# EAGLE design circuit (EAGLE 9.6.0)
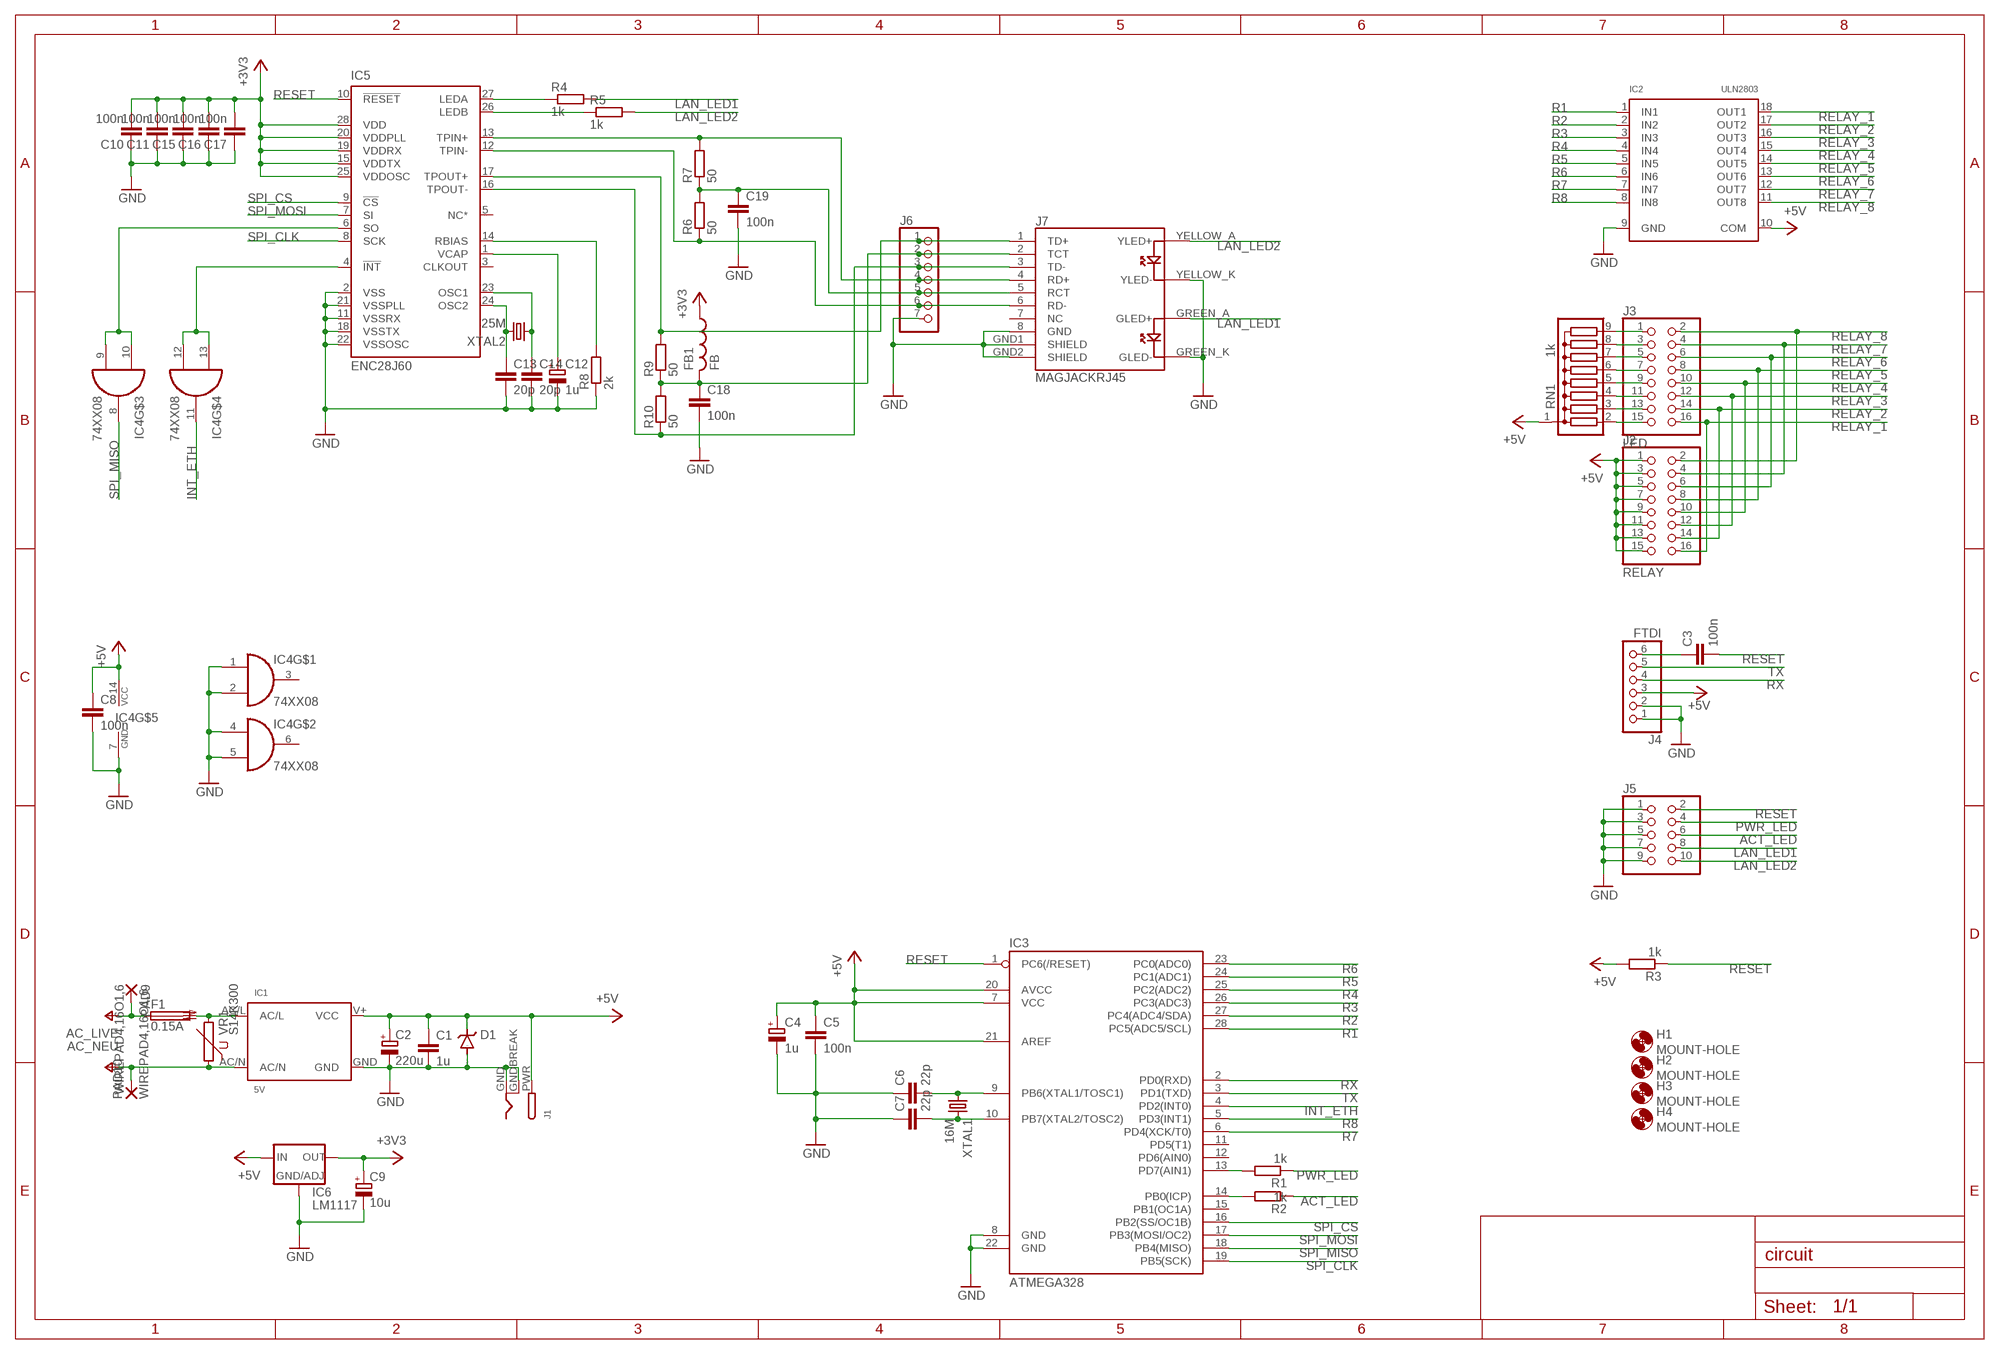
[diagram p0: schematic, sheet 1]

## Parts
C1  1u  CAPACITORC050-025X075  [C050-025X075]
C2  220u  CAPACITOR_POL2.5/6  [E2,5-6]
C3  100n  CAPACITORC050-025X075  [C050-025X075]
C4  1u  CAPACITOR_POL5/5  [E5-5]
C5  100n  CAPACITORC050-025X075  [C050-025X075]
C6  22p  CAPACITORC025-025X050  [C025-025X050]
C7  22p  CAPACITORC025-025X050  [C025-025X050]
C8  100n  CAPACITORC050-025X075  [C050-025X075]
C9  10u  CAPACITOR_POL5/5  [E5-5]
C10  100n  CAPACITORC050-025X075  [C050-025X075]
C11  100n  CAPACITORC050-025X075  [C050-025X075]
C12  1u  CAPACITOR_POL5/5  [E5-5]
C13  20p  CAPACITORC025-025X050  [C025-025X050]
C14  20p  CAPACITORC025-025X050  [C025-025X050]
C15  100n  CAPACITORC050-025X075  [C050-025X075]
C16  100n  CAPACITORC050-025X075  [C050-025X075]
C17  100n  CAPACITORC050-025X075  [C050-025X075]
C18  100n  CAPACITORC050-025X075  [C050-025X075]
C19  100n  CAPACITORC050-025X075  [C050-025X075]
D1  DIODE-TVSDO15  [DO15]
F1  0.15A  5X20_FUSE  [5X20_FUSE]
FB1  FB  [FB]
H1  MOUNT-HOLE  [3,2]
H2  MOUNT-HOLE  [3,2]
H3  MOUNT-HOLE  [3,2]
H4  MOUNT-HOLE  [3,2]
IC1  5V  AC-DC_PSUAMEL10  [LD/AMEL10]
IC2  ULN2803  [DIL18]
IC3  ATMEGA328  [DIL28]
IC4  74XX08  [DIL14]
IC5  ENC28J60  [DIL28]
IC6  LM1117  [TO220V]
J1  DCBARRELPTH  [DCJACK_2MM_PTH]
J2  RELAY  PINHD-2X8  [2X08]
J3  LED  PINHD-2X8  [2X08]
J4  FTDI  PINHD-1X6  [1X06]
J5  PINHD-2X5  [2X05]
J6  PINHD-1X7  [1X07]
J7  MAGJACKRJ45  [MAGJACK]
PAD9  WIREPAD4,16O1,6  [4,16O1,6]
PAD10  WIREPAD4,16O1,6  [4,16O1,6]
R1  1k  RESISTOR  [0207/10]
R2  1k  RESISTOR  [0207/10]
R3  1k  RESISTOR  [0207/10]
R4  1k  RESISTOR  [0207/10]
R5  1k  RESISTOR  [0207/10]
R6  50  RESISTOR  [0207/10]
R7  50  RESISTOR  [0207/10]
R8  2k  RESISTOR  [0207/10]
R9  50  RESISTOR  [0207/10]
R10  50  RESISTOR  [0207/10]
RN1  1k  G08R  [SIL9]
VR1  S14K300  [S14K300]
XTAL1  16M  CRYSTAL  [HC49/S]
XTAL2  25M  CRYSTAL  [HC49/S]

## Nets
+3V3: C9.+ C10.2 C11.2 C15.2 C16.2 C17.2 FB1.P$1 IC5.15(VDDTX) IC5.19(VDDRX) IC5.20(VDDPLL) IC5.25(VDDOSC) IC5.28(VDD) IC6.2(OUT)
+5V: C1.1 C2.+ C4.+ C5.1 C8.1 D1.C IC1.V+(VCC) IC2.10(COM) IC3.7(VCC) IC3.20(AVCC) IC3.21(AREF) IC4.14(VCC) IC6.3(IN) J1.PWR J2.1 J2.3 J2.5 J2.7 J2.9 J2.11 J2.13 J2.15 J4.3 R3.2 RN1.1
ACT_LED: J5.6 R2.1
GND: C1.2 C2.- C4.- C5.2 C6.1 C7.1 C8.2 C9.- C10.1 C11.1 C12.- C13.2 C14.2 C15.1 C16.1 C17.1 C18.2 C19.2 D1.A IC1.GND IC2.9(GND) IC3.8(GND) IC3.22(GND) IC4.1(I0) IC4.2(I1) IC4.4(I0) IC4.5(I1) IC4.7(GND) IC5.2(VSS) IC5.11(VSSRX) IC5.18(VSSTX) IC5.21(VSSPLL) IC5.22(VSSOSC) IC6.1(GND/ADJ) J1.GND J1.GNDBREAK J4.1 J4.2 J5.1 J5.3 J5.5 J5.7 J5.9 J6.7 J7.8(GND) J7.GND1(SHIELD) J7.GND2(SHIELD) J7.GREEN_K(GLED-) J7.YELLOW_K(YLED-) R8.1
INT_ETH: IC3.4(PD2(INT0)) IC4.11(O)
LAN_LED1: J5.8 J7.GREEN_A(GLED+) R4.2
LAN_LED2: J5.10 J7.YELLOW_A(YLED+) R5.2
N$3: IC5.16(TPOUT-) J6.3 J7.3(TD-) R10.1
N$4: C19.1 J6.5 J7.5(RCT) R6.2 R7.1
N$5: IC5.17(TPOUT+) J6.1 J7.1(TD+) R9.2
N$7: J3.15 RN1.2
N$8: J3.13 RN1.3
N$9: F1.2A F1.2B IC1.AC/L VR1.2
N$10: IC4.9(I1) IC4.10(I0) IC5.6(SO)
N$11: J3.11 RN1.4
N$12: IC4.12(I1) IC4.13(I0) IC5.4(!INT)
N$13: J3.9 RN1.5
N$14: J3.7 RN1.6
N$15: J3.5 RN1.7
N$16: J3.3 RN1.8
N$18: C18.1 FB1.P$2 J6.2 J7.2(TCT) R9.1 R10.2
N$20: IC5.13(TPIN+) J6.4 J7.4(RD+) R7.2
N$22: IC5.12(TPIN-) J6.6 J7.6(RD-) R6.1
N$25: IC5.27(LEDA) R4.1
N$26: IC5.26(LEDB) R5.1
N$27: IC3.13(PD7(AIN1)) R1.2
N$28: IC3.14(PB0(ICP)) R2.2
N$29: J3.1 RN1.9
N$32: C3.1 J4.6
N$33: C13.1 IC5.24(OSC2) XTAL2.2
N$34: C14.1 IC5.23(OSC1) XTAL2.1
N$35: C12.+ IC5.1(VCAP)
N$36: IC5.14(RBIAS) R8.2
N$38: C6.2 IC3.9(PB6(XTAL1/TOSC1)) XTAL1.1
N$39: C7.2 IC3.10(PB7(XTAL2/TOSC2)) XTAL1.2
PWR_LED: J5.4 R1.1
R1: IC2.1(IN1) IC3.28(PC5(ADC5/SCL))
R2: IC2.2(IN2) IC3.27(PC4(ADC4/SDA))
R3: IC2.3(IN3) IC3.26(PC3(ADC3))
R4: IC2.4(IN4) IC3.25(PC2(ADC2))
R5: IC2.5(IN5) IC3.24(PC1(ADC1))
R6: IC2.6(IN6) IC3.23(PC0(ADC0))
R7: IC2.7(IN7) IC3.6(PD4(XCK/T0))
R8: IC2.8(IN8) IC3.5(PD3(INT1))
RELAY_1: IC2.18(OUT1) J2.16 J3.16
RELAY_2: IC2.17(OUT2) J2.14 J3.14
RELAY_3: IC2.16(OUT3) J2.12 J3.12
RELAY_4: IC2.15(OUT4) J2.10 J3.10
RELAY_5: IC2.14(OUT5) J2.8 J3.8
RELAY_6: IC2.13(OUT6) J2.6 J3.6
RELAY_7: IC2.12(OUT7) J2.4 J3.4
RELAY_8: IC2.11(OUT8) J2.2 J3.2
RESET: C3.2 IC3.1(PC6(/RESET)) IC5.10(!RESET) J5.2 R3.1
RX: IC3.2(PD0(RXD)) J4.4
SPI_CLK: IC3.19(PB5(SCK)) IC5.8(SCK)
SPI_CS: IC3.16(PB2(SS/OC1B)) IC5.9(!CS)
SPI_MISO: IC3.18(PB4(MISO)) IC4.8(O)
SPI_MOSI: IC3.17(PB3(MOSI/OC2)) IC5.7(SI)
TX: IC3.3(PD1(TXD)) J4.5
V+: F1.1A F1.1B PAD9.1(P) ; supply symbol labelled AC_LIVE
V-: IC1.AC/N PAD10.1(P) VR1.1 ; supply symbol labelled AC_NEU
Unconnected: IC3.11(PD5(T1)) IC3.12(PD6(AIN0)) IC3.15(PB1(OC1A)) IC4.3(O) IC4.6(O) IC5.3(CLKOUT) IC5.5(NC*) J7.7(NC)

## Library data of the parts
C1 C3 C5-C8 C10 C11 C13-C19 = THT:CAPACITOR
C2 C4 C9 C12 = THT:CAPACITOR_POL
D1 = THT:DIODE-TVS
F1 = THT:5X20_FUSE
FB1 = THT:FB: Ferrite bead Digikey #P9821BK-ND
H1-H4 = THT:MOUNT-HOLE
IC1 = THT:AC-DC_PSU
IC2 = THT:ULN2803
IC3 = THT:ATMEGA328
IC4 = THT:74XX08
IC5 = THT:ENC28J60
IC6 = THT:LM1117
J1 = THT:DCBARREL: 2.0mm DC Barrel Jack DCJACK_2MM_PTH - Through Hole Jack (4UConnector: 05537)
J2 J3 = THT:PINHD-2X8: PIN HEADER
J4 = THT:PINHD-1X6: PIN HEADER
J5 = THT:PINHD-2X5: PIN HEADER
J6 = THT:PINHD-1X7: PIN HEADER
J7 = THT:MAGJACK: MAGJACK: RJ-45 with LEDs This is a single port, RJ45 ethernet jacks with built in transformer (magnetics), status LEDs, and shielding. Here is the connector we sell at SparkFun: RJ45 Ethernet MagJack-Compatible <https://www.sparkfun.com/products/8534> (PRT-08534) Datasheet <http://www.sparkfun.com/datasheets/Prototyping/MagJack.pdf> It is used on this SparkFun product: SparkFun RJ45 MagJack Breakout <https://www.sparkfun.com/products/13021> (BOB-13021)
PAD9 PAD10 = THT:WIREPAD: Wire PAD connect wire on PCB
R1-R10 = THT:RESISTOR
RN1 = THT:G08R: SIL RESISTOR; OC_FARNELL: unknown; OC_NEWARK: unknown
VR1 = THT:S14K300: VARISTOR
XTAL1 XTAL2 = THT:CRYSTAL

## Board
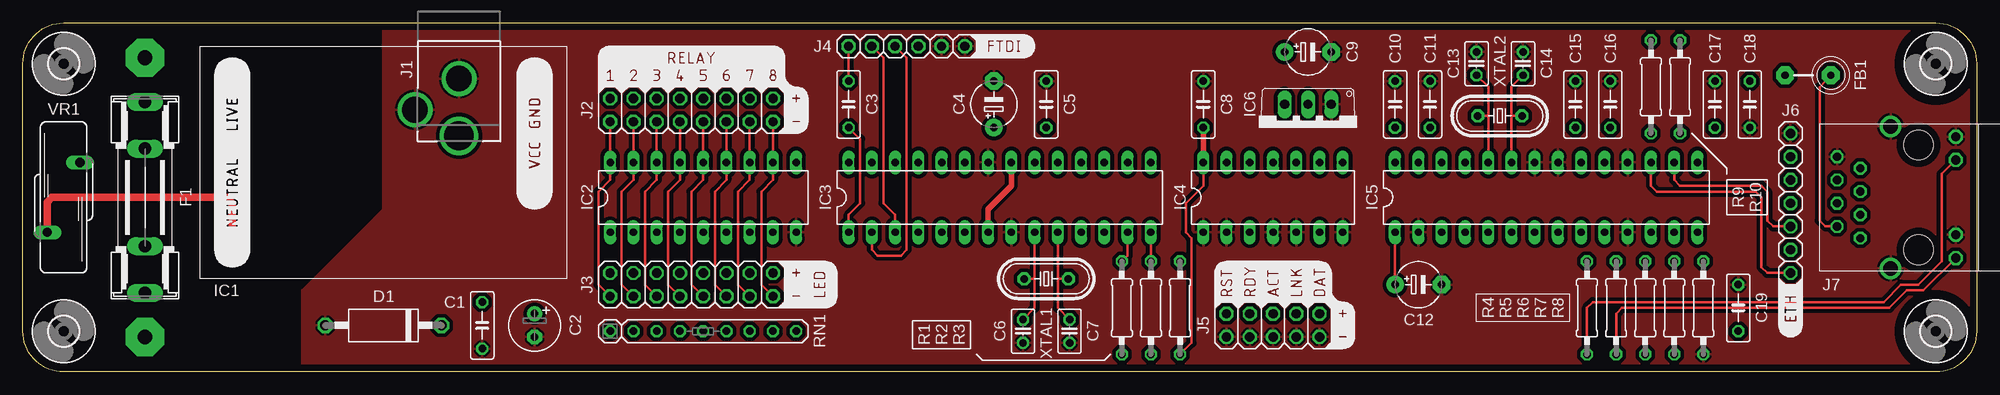
[diagram p1: board, top side]
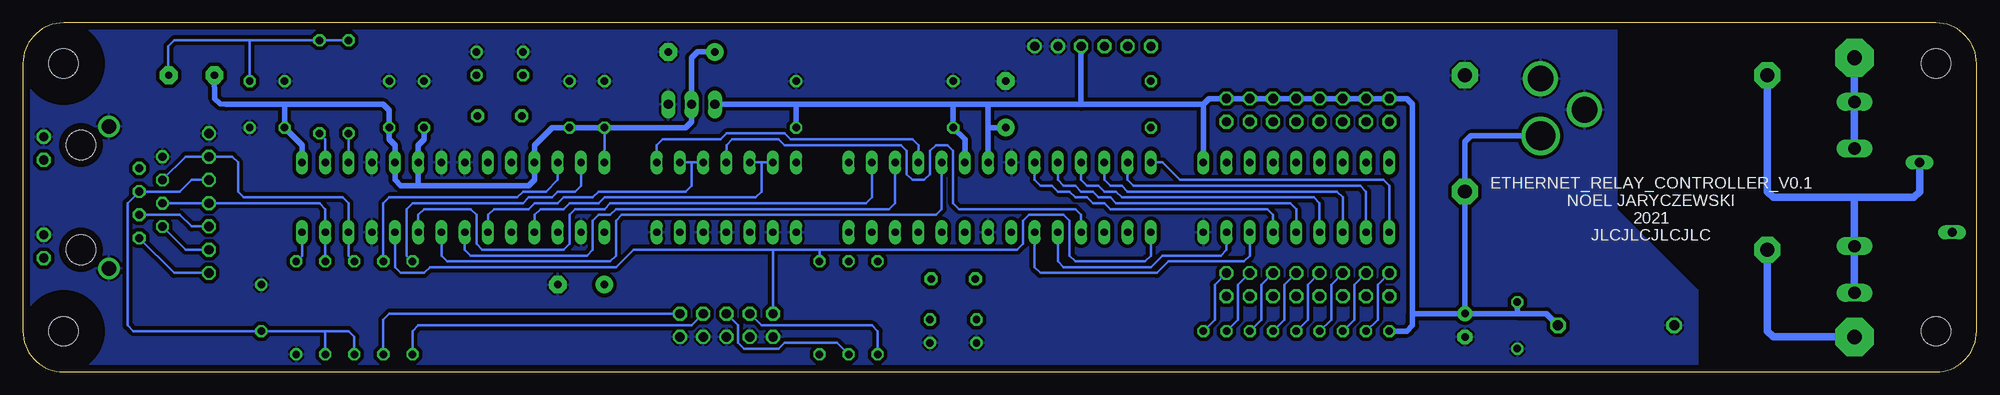
[diagram p2: board, bottom side, seen from below]

Size 213.36 x 38.1 mm. Coordinates in mm from the lower left corner, seen from the top.
Outline: 213.36,33.66 213.36,4.45 arc-90 208.91,0 4.45,0 arc-90 0,4.45 0,33.66 arc-90 4.45,38.1 208.91,38.1 arc-90 213.36,33.66
Copper layers (1*16): Top 0.035mm / dielectric 1.5mm / Bottom 0.035mm
Design rules "default *": minimum track width 8mil, minimum drill 0.4mm, track to track 8mil, track to pad 8mil, pad to pad 8mil, via to via 8mil, smd to smd 8mil, copper to edge 30mil, drill to drill 8mil, minimum pad ring 10mil, minimum via ring 8mil, stop-mask expansion 4mil, vias tented up to drill 0mil, thermal gap 10mil

### Footprints (pad centres in the part's own frame; a part is rotated, then mirrored left to right if it is on the bottom)
C050-025X075 = drill 0.813 octagon: 1 -2.54,0; 2 2.54,0
E2,5-6 = drill 0.813 pad 1.6: + -1.27,0 | drill 0.813 pad 1.6 octagon: - 1.27,0
E5-5 = drill 0.813 pad 1.905: + -2.54,0 | drill 0.813 pad 1.905 octagon: - 2.54,0
C025-025X050 = drill 0.813 octagon: 1 -1.27,0; 2 1.27,0
DO15 = drill 1.118 octagon: A 6.35,0; C -6.35,0
5X20_FUSE = drill 1.321 pad 1.905 long: 1A -10.414,0; 1B -5.334,0; 2A 10.414,0; 2B 5.334,0
FB = drill 0.8 pad 1.93 octagon: P$1 -2.5,0; P$2 2.5,0
3,2 = hole 3.2: 0,0
LD/AMEL10 = drill 1.5 pad 2.8 octagon: AC/L -16.51,9.525; AC/N -16.51,-9.525; GND 16.51,9.525; V+ 16.51,-3.175
DIL18 = drill 0.813 long: 1 -10.16,-3.81; 2 -7.62,-3.81; 3 -5.08,-3.81; 4 -2.54,-3.81; 5 0,-3.81; 6 2.54,-3.81; 7 5.08,-3.81; 8 7.62,-3.81; 9 10.16,-3.81; 10 10.16,3.81; 11 7.62,3.81; 12 5.08,3.81; 13 2.54,3.81; 14 0,3.81; 15 -2.54,3.81; 16 -5.08,3.81; 17 -7.62,3.81; 18 -10.16,3.81
DIL28 = drill 0.813 long: 1 -16.51,-3.81; 2 -13.97,-3.81; 3 -11.43,-3.81; 4 -8.89,-3.81; 5 -6.35,-3.81; 6 -3.81,-3.81; 7 -1.27,-3.81; 8 1.27,-3.81; 9 3.81,-3.81; 10 6.35,-3.81; 11 8.89,-3.81; 12 11.43,-3.81; 13 13.97,-3.81; 14 16.51,-3.81; 15 16.51,3.81; 16 13.97,3.81; 17 11.43,3.81; 18 8.89,3.81; 19 6.35,3.81; 20 3.81,3.81; 21 1.27,3.81; 22 -1.27,3.81; 23 -3.81,3.81; 24 -6.35,3.81; 25 -8.89,3.81; 26 -11.43,3.81; 27 -13.97,3.81; 28 -16.51,3.81
DIL14 = drill 0.813 long: 1 -7.62,-3.81; 2 -5.08,-3.81; 3 -2.54,-3.81; 4 0,-3.81; 5 2.54,-3.81; 6 5.08,-3.81; 7 7.62,-3.81; 8 7.62,3.81; 9 5.08,3.81; 10 2.54,3.81; 11 0,3.81; 12 -2.54,3.81; 13 -5.08,3.81; 14 -7.62,3.81
TO220V = drill 1.016 long: 1 -2.54,-2.54; 2 0,-2.54; 3 2.54,-2.54
DCJACK_2MM_PTH = drill 2.8: GND 0,7.35; GNDBREAK 4.8,10.75 | drill 3.2: PWR 0,13.6
2X08 = drill 1.016 octagon: 1 -8.89,-1.27; 2 -8.89,1.27; 3 -6.35,-1.27; 4 -6.35,1.27; 5 -3.81,-1.27; 6 -3.81,1.27; 7 -1.27,-1.27; 8 -1.27,1.27; 9 1.27,-1.27; 10 1.27,1.27; 11 3.81,-1.27; 12 3.81,1.27; 13 6.35,-1.27; 14 6.35,1.27; 15 8.89,-1.27; 16 8.89,1.27
1X06 = drill 1.016 octagon: 1 -6.35,0; 2 -3.81,0; 3 -1.27,0; 4 1.27,0; 5 3.81,0; 6 6.35,0
2X05 = drill 1.016 octagon: 1 -5.08,-1.27; 2 -5.08,1.27; 3 -2.54,-1.27; 4 -2.54,1.27; 5 0,-1.27; 6 0,1.27; 7 2.54,-1.27; 8 2.54,1.27; 9 5.08,-1.27; 10 5.08,1.27
1X07 = drill 1.016 octagon: 1 -7.62,0; 2 -5.08,0; 3 -2.54,0; 4 0,0; 5 2.54,0; 6 5.08,0; 7 7.62,0
MAGJACK = drill 0.889 octagon: 1 -4.445,6.35; 2 -3.175,8.89; 3 -1.905,6.35; 4 -0.635,8.89; 5 0.635,6.35; 6 1.905,8.89; 7 3.175,6.35; 8 4.445,8.89 | drill 1.575: GND1 -7.747,3.048; GND2 7.747,3.048 | drill 1.016 octagon: GREEN_A 4.089,-4.064; GREEN_K 6.629,-4.064; YELLOW_A -6.629,-4.064; YELLOW_K -4.089,-4.064 | hole 3.251: -5.715,0; 5.715,0
4,16O1,6 = drill 1.6 pad 4.166 octagon: 1 0,0
0207/10 = drill 0.813 octagon: 1 -5.08,0; 2 5.08,0
SIL9 = drill 0.813 octagon: 1 -10.16,0; 2 -7.62,0; 3 -5.08,0; 4 -2.54,0; 5 0,0; 6 2.54,0; 7 5.08,0; 8 7.62,0; 9 10.16,0
S14K300 = drill 1.016 long: 1 -1.778,-3.81; 2 1.778,3.81
HC49/S = drill 0.813 pad 1.422 octagon: 1 -2.413,0; 2 2.413,0

### Placement (x,y rotation side)
C1  50.16,5.08 270 top
C2  55.88,5.08 270 top
C3  90.17,29.21 270 top
C4  106.05,29.21 90 top
C5  111.76,29.21 90 top
C6  109.22,4.45 90 top
C7  114.3,4.45 90 top
C8  128.91,29.21 90 top
C9  140.34,34.92 0 top
C10  149.86,29.21 270 top
C11  153.67,29.21 270 top
C12  152.4,9.53 0 top
C13  158.75,33.66 90 top
C14  163.83,33.66 90 top
C15  169.54,29.21 270 top
C16  173.35,29.21 270 top
C17  184.78,29.21 270 top
C18  188.59,29.21 270 top
C19  187.32,6.99 90 top
D1  39.37,5.08 180 top
F1  13.34,19.05 270 top
FB1  194.94,32.38 0 top
H1  208.91,4.45 0 top
H2  208.91,33.66 0 top
H3  4.45,33.66 0 top
H4  4.45,4.45 0 top
IC1  39.37,22.86 0 top
IC2  74.3,19.05 0 top
IC3  106.68,19.05 0 top
IC4  136.53,19.05 0 top
IC5  166.37,19.05 0 top
IC6  140.34,26.67 180 top
J1  47.62,39.37 180 top
J2  73.03,28.57 180 top
J3  73.03,9.53 180 top
J4  96.52,35.56 180 top
J5  136.53,5.08 0 top
J6  193.04,18.41 90 top
J7  207.01,19.05 90 top
PAD9  13.34,34.29 180 top
PAD10  13.34,3.81 180 top
R1  120.02,6.99 90 top
R2  123.19,6.99 90 top
R3  126.36,6.99 270 top
R4  170.81,6.99 270 top
R5  173.99,6.99 270 top
R6  177.16,6.99 270 top
R7  180.34,6.99 90 top
R8  183.51,6.99 90 top
R9  177.8,31.11 270 top
R10  180.97,31.11 90 top
RN1  74.3,4.45 0 top
VR1  4.45,19.05 0 top
XTAL1  111.76,10.16 0 top
XTAL2  161.29,27.94 180 top

### Tracks (layer width: path | path; a pad name or v marks a point on that pad's centre or on a via)
+3V3
  Bottom 0.254: C10.2 IC5.28
  Bottom 0.61: C15.2 169.54,25.4 170.18,24.77 IC5.20 170.18,20.32 | C9.+ 139.7,34.92 140.34,34.29 IC6.2 140.34,27.3 140.97,26.67 C10.2 C11.2 155.57,26.67 157.48,24.77 IC5.25 157.48,20.95 158.12,20.32 170.18,20.32 | 170.18,20.32 172.09,20.32 172.72,20.95 IC5.19 172.72,24.77 173.35,25.4 C16.2 173.35,28.57 173.99,29.21 184.78,29.21 | 184.78,29.21 C17.2 182.88,24.77 IC5.15 | 184.78,29.21 191.18,29.21 191.81,29.25 192.41,29.84 FB1.P$1
+5V
  Top 0.254: R3.2 127.64,3.17 127.64,14.61 127,15.24 127,18.41 128.91,20.32 IC4.14
  Top 0.61: C8.1 IC4.14 | IC3.7 105.41,17.78 107.95,20.32 IC3.21
  Bottom 0.61: 84.45,29.21 83.82,29.84 J2.1 J2.3 J2.5 J2.7 J2.9 J2.11 J2.13 J2.15 62.23,29.84 61.59,29.21 61.59,6.35 | 84.45,29.21 97.79,29.21 | 97.79,29.21 107.95,29.21 | 107.95,29.21 111.76,29.21 | 111.76,29.21 C5.1 110.49,25.4 IC3.20 | J4.3 97.79,29.21 | IC2.10 84.45,29.21 | IC3.21 107.95,26.67 | 107.95,26.67 107.95,29.21 | C4.+ 107.95,26.67 | 111.76,29.21 128.91,29.21 | 128.91,29.21 IC6.3 | C8.1 128.91,29.21 | C2.+ IC1.V+ 55.88,25.14 55.24,25.77 J1.PWR | C1.1 50.16,6.35 | 50.16,6.35 C2.+ | 50.16,6.35 46.99,6.35 D1.C | 61.59,6.35 C2.+ | RN1.1 62.23,4.45 61.59,5.08 61.59,6.35
ACT_LED
  Bottom 0.254: R2.1 124.46,3.17 130.18,3.17 130.81,2.54 134.62,2.54 135.25,3.17 135.25,5.08 J5.6
GND
  pour Top (isolate 0.406): 39.37,38.1 39.37,17.78 30.48,8.89 30.48,0 213.36,0 213.36,38.1
  pour Bottom (isolate 0.406): 39.37,38.1 39.37,17.78 30.48,8.89 30.48,0 213.36,0 213.36,38.1
INT_ETH
  Bottom 0.254: IC4.11 136.53,24.77 135.89,25.4 130.81,25.4 130.18,24.77 117.47,24.77 116.84,24.13 116.84,21.59 116.2,20.95 114.94,20.95 114.3,21.59 114.3,24.13 113.67,24.77 112.39,24.77 111.76,24.13 111.76,18.41 111.12,17.78 98.42,17.78 97.79,17.14 IC3.4
LAN_LED1
  Top 0.254: R4.2 170.81,6.99 171.45,7.62 203.2,7.62 205.1,9.53 207.01,9.53 209.55,12.06 209.55,21.61 J7.GREEN_A
  Bottom 0.254: R4.2 170.81,4.45 170.18,5.08 140.34,5.08 J5.8
LAN_LED2
  Top 0.254: R5.2 173.99,6.35 174.62,6.99 203.84,6.99 205.74,8.89 207.54,8.89 J7.YELLOW_A
  Bottom 0.254: J5.10 173.35,6.35 173.99,5.71 R5.2
N$3
  Top 0.254: IC5.16 180.34,20.95 180.97,20.32 189.87,20.32 190.5,19.68 190.5,16.51 191.13,15.88 J6.3
  Bottom 0.254: R10.1 180.34,25.4 IC5.16 | J6.3 194.94,15.88 196.22,17.14 J7.3
N$4
  Bottom 0.254: R6.2 177.16,3.81 177.8,4.45 180.34,4.45 | 180.34,4.45 C19.1 201.29,4.45 201.93,5.08 201.93,18.41 J7.5 196.22,19.68 194.94,20.95 J6.5 | R7.1 180.34,4.45
N$5
  Top 0.254: IC5.17 177.8,20.32 178.44,19.68 189.23,19.68 189.87,19.05 189.87,11.43 190.5,10.79 J6.1
  Bottom 0.254: R9.2 IC5.17 | J6.1 196.85,10.79 J7.1
N$7
  Bottom 0.254: RN1.2 65.41,5.71 65.41,9.53 J3.15
N$8
  Bottom 0.254: RN1.3 67.94,5.71 67.94,9.53 J3.13
N$9
  Bottom 0.813: F1.2A F1.2B 13.34,19.05 | VR1.2 6.22,19.68 6.86,19.05 13.34,19.05 | IC1.AC/L 22.86,19.68 22.23,19.05 13.34,19.05
N$10
  Bottom 0.254: IC4.10 140.34,22.86 | 140.34,22.86 IC4.9 | IC5.6 162.56,17.14 161.93,17.78 158.12,17.78 157.48,18.41 154.94,18.41 154.31,19.05 151.13,19.05 150.5,19.68 140.97,19.68 140.34,20.32 140.34,22.86
N$11
  Bottom 0.254: RN1.4 70.48,5.71 70.48,9.53 J3.11
N$12
  Bottom 0.254: IC4.13 132.72,22.86 | 132.72,22.86 IC4.12 | IC5.4 157.48,17.14 156.84,17.78 154.31,17.78 153.67,18.41 150.5,18.41 149.86,19.05 133.35,19.05 132.72,19.68 132.72,22.86
N$13
  Bottom 0.254: RN1.5 73.03,5.71 73.03,9.53 J3.9
N$14
  Bottom 0.254: RN1.6 75.56,5.71 75.56,9.53 J3.7
N$15
  Bottom 0.254: RN1.7 78.11,5.71 78.11,9.53 J3.5
N$16
  Bottom 0.254: RN1.8 80.64,5.71 80.64,9.53 J3.3
N$18
  Top 0.254: FB1.P$2 196.22,31.07 196.22,16.51 196.85,15.88 J7.2
  Bottom 0.254: R9.1 R10.2 188.59,36.2 | J6.2 195.58,13.34 J7.2 | 188.59,36.2 196.85,36.2 197.49,35.56 197.49,32.42 FB1.P$2 | C18.1 188.59,36.2
N$20
  Bottom 0.254: R7.2 IC5.13 180.34,17.78 180.97,18.41 J6.4 J7.4
N$22
  Bottom 0.254: R6.1 177.8,12.7 IC5.12 177.8,18.41 178.44,19.05 189.23,19.05 189.87,19.68 189.87,22.86 190.5,23.5 J6.6 195.58,23.5 J7.6
N$25
  Bottom 0.254: IC5.27 152.4,20.32 153.03,19.68 154.94,19.68 155.57,19.05 158.12,19.05 158.75,18.41 170.81,18.41 171.45,17.78 171.45,12.7 R4.1
N$26
  Bottom 0.254: IC5.26 154.94,20.95 156.21,19.68 158.75,19.68 159.38,19.05 173.35,19.05 173.99,18.41 R5.1
N$27
  Top 0.254: IC3.13 120.65,12.7 R1.2
N$28
  Top 0.254: R2.2 IC3.14
N$29
  Bottom 0.254: RN1.9 83.19,5.71 83.19,9.53 J3.1
N$32
  Top 0.254: J4.6 C3.1
N$33
  Top 0.254: C13.1 160.02,31.11 160.02,27.94 | 160.02,27.94 IC5.24 | XTAL2.2 160.02,27.94
N$34
  Top 0.254: C14.1 162.56,31.11 162.56,27.94 | 162.56,27.94 IC5.23 | XTAL2.1 162.56,27.94
N$35
  Top 0.254: IC5.1 C12.+
N$36
  Bottom 0.254: R8.2 182.88,12.7 IC5.14
N$38
  Top 0.254: IC3.9 110.49,10.16 | 110.49,10.16 110.49,6.99 C6.2 | XTAL1.1 110.49,10.16
N$39
  Top 0.254: IC3.10 113.03,10.16 | 113.03,10.16 113.03,6.99 C7.2 | XTAL1.2 113.03,10.16
PWR_LED
  Bottom 0.254: R1.1 120.02,4.45 120.65,5.08 132.72,5.08 J5.4
R1
  Bottom 0.254: IC3.28 88.9,22.86 87,20.95 64.77,20.95 64.14,20.32 IC2.1
R2
  Bottom 0.254: IC3.27 92.71,20.95 92.08,20.32 67.31,20.32 66.67,19.68 IC2.2
R3
  Bottom 0.254: IC3.26 95.25,20.95 94.61,20.32 93.34,20.32 92.71,19.68 69.85,19.68 69.22,19.05 IC2.3
R4
  Bottom 0.254: IC3.25 97.79,20.95 97.16,20.32 95.89,20.32 95.25,19.68 93.98,19.68 93.34,19.05 72.39,19.05 71.75,18.41 IC2.4
R5
  Bottom 0.254: IC3.24 100.33,20.95 99.69,20.32 98.42,20.32 97.79,19.68 96.52,19.68 95.89,19.05 94.61,19.05 93.98,18.41 74.93,18.41 74.3,17.78 IC2.5
R6
  Bottom 0.254: IC3.23 102.87,20.95 102.23,20.32 100.97,20.32 100.33,19.68 99.06,19.68 98.42,19.05 97.16,19.05 96.52,18.41 95.25,18.41 94.61,17.78 77.47,17.78 76.83,17.14 IC2.6
R7
  Bottom 0.254: IC2.7 79.38,12.7 80.01,12.06 88.27,12.06 89.53,10.79 102.23,10.79 102.87,11.43 IC3.6
R8
  Bottom 0.254: IC2.8 81.92,13.34 82.55,12.7 88.9,12.7 90.17,11.43 99.69,11.43 100.33,12.06 IC3.5
RELAY_1
  Top 0.254: J3.16 62.87,9.53 62.87,19.68 64.14,20.95 IC2.18 J2.16
RELAY_2
  Top 0.254: J3.14 65.41,9.53 65.41,19.68 66.67,20.95 IC2.17 J2.14
RELAY_3
  Top 0.254: J3.12 67.94,9.53 67.94,19.68 69.22,20.95 IC2.16 J2.12
RELAY_4
  Top 0.254: J3.10 70.48,9.53 70.48,19.68 71.75,20.95 IC2.15 J2.10
RELAY_5
  Top 0.254: J3.8 73.03,9.53 73.03,19.68 74.3,20.95 IC2.14 J2.8
RELAY_6
  Top 0.254: J3.6 75.56,9.53 75.56,19.68 76.83,20.95 IC2.13 J2.6
RELAY_7
  Top 0.254: J3.4 78.11,9.53 78.11,19.68 79.38,20.95 IC2.12 J2.4
RELAY_8
  Top 0.254: J3.2 80.64,9.53 80.64,19.68 81.92,20.95 IC2.11 J2.2
RESET
  Top 0.254: C3.2 91.44,25.4 91.44,18.41 90.17,17.14 IC3.1
  Bottom 0.254: IC5.10 172.72,11.43 172.09,10.79 169.54,10.79 168.91,11.43 148.59,11.43 146.69,13.34 131.44,13.34 | IC3.1 90.17,12.7 90.81,12.06 98.42,12.06 99.06,12.7 99.06,16.51 99.69,17.14 103.5,17.14 104.14,16.51 104.14,13.97 104.78,13.34 126.36,13.34 | J5.2 131.44,13.34 | 126.36,13.34 131.44,13.34 | R3.1 126.36,13.34
RX
  Top 0.254: J4.4 96.52,34.29 96.52,13.34 95.89,12.7 93.34,12.7 92.71,13.34 IC3.2
SPI_CLK
  Bottom 0.254: IC5.8 167.64,12.7 167,12.06 149.22,12.06 148.59,12.7 148.59,16.51 147.96,17.14 113.67,17.14 113.03,17.78 IC3.19
SPI_CS
  Bottom 0.254: IC3.16 120.65,19.05 121.28,18.41 149.22,18.41 149.86,17.78 153.03,17.78 153.67,17.14 153.67,13.97 154.31,13.34 163.19,13.34 163.83,13.97 163.83,17.14 164.47,17.78 169.54,17.78 170.18,17.14 IC5.9
SPI_MISO
  Bottom 0.254: IC3.18 115.57,24.77 116.2,25.4 129.54,25.4 130.18,26.04 136.53,26.04 137.16,25.4 143.51,25.4 144.15,24.77 IC4.8
SPI_MOSI
  Bottom 0.254: IC3.17 118.11,18.41 118.75,17.78 148.59,17.78 149.22,17.14 150.5,17.14 151.13,16.51 151.13,13.34 151.76,12.7 164.47,12.7 165.1,13.34 IC5.7
TX
  Top 0.254: J4.5 93.98,34.29 93.98,18.41 95.25,17.14 IC3.3
V+
  Bottom 0.813: PAD9.1 F1.1A F1.1B
V-
  Top 0.813: IC1.AC/N 22.86,18.41 22.23,19.05 3.17,19.05 2.67,18.54 VR1.1
  Bottom 0.813: IC1.AC/N 22.86,4.45 22.23,3.81 PAD10.1

### Text on the board
bPlace: ETHERNET_RELAY_CONTROLLER_V0.1 / NOEL JARYCZEWSKI / 2021 / JLCJLCJLCJLC